# Altium project Biological Payload Data Consolidator.PrjPcb
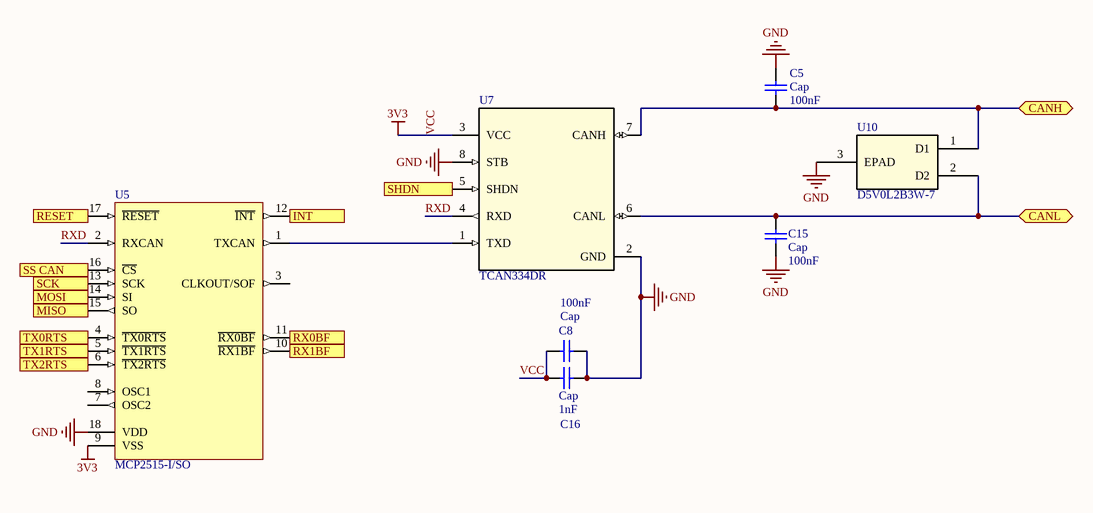
[diagram p0: CAN 3V3new.SchDoc]
8 sheets, 63 parts. Net scope: hierarchical (ports join the sheet entries above them; power ports are global).
Board file: Biological Payload Data Consolidator.PcbDoc
Sheets:
  CAN 3V3new.SchDoc
  BPDC high.SchDoc
    Designator = LSM6DSMTR.SchDoc
    Designator = Biological Payload Data Consolidator.SchDoc
    Boost = Boost.SchDoc
    Designator = Temp Sensor.SchDoc
    Designator = BPDC mid.SchDoc
      Thermo1 = Thermocouple.SchDoc
      Thermo2 = Thermocouple.SchDoc
      Thermo3 = Thermocouple.SchDoc
      Thermo4 = Thermocouple.SchDoc

## Sheet CAN 3V3new.SchDoc
size A

### Parts
C5  Cap  value 100nF  [1608[0603]]
C8  Cap  value 100nF  [1608[0603]]
C15  Cap  value 100nF  [1608[0603]]
C16  Cap  value 1nF  [1608[0603]]
U5  MCP2515-I/SO  [SOIC-SO18_L]
U7  TCAN334DR  [D0008A_N]
U10  D5V0L2B3W-7  [SOT-323_DIO]

### Ports
CANH (bidir), CANL (bidir), INT (out), MISO (out), MOSI (in), RESET (in), RX0BF (out), RX1BF (out), SCK (in), SHDN (in), SS CAN (in), TX0RTS (in), TX1RTS (in), TX2RTS (in)

### Nets
GND: C5.1 C8.2 C15.1 C16.1 U5.18(VDD) U7.2(GND) U7.8(STB) U10.3(EPAD)
VCC: C8.1 C16.2 U5.9(VSS) U7.3(VCC)  [also labelled 3V3]
RXD: U5.2(RXCAN) U7.4(RXD)
NetC5_2: C5.2 U7.7(CANH) U10.1(D1) ; port CANH
NetC15_2: C15.2 U7.6(CANL) U10.2(D2) ; port CANL
NetU5_1: U5.1(TXCAN) U7.1(TXD)
NetU5_4: U5.4(~{TX0RTS}) ; port TX0RTS
NetU5_5: U5.5(~{TX1RTS}) ; port TX1RTS
NetU5_6: U5.6(~{TX2RTS}) ; port TX2RTS
NetU5_10: U5.10(~{RX1BF}) ; port RX1BF
NetU5_11: U5.11(~{RX0BF}) ; port RX0BF
NetU5_12: U5.12(~{INT}) ; port INT
NetU5_13: U5.13(SCK) ; port SCK
NetU5_14: U5.14(SI) ; port MOSI
NetU5_15: U5.15(SO) ; port MISO
NetU5_16: U5.16(~{CS}) ; port SS CAN
NetU5_17: U5.17(~{RESET}) ; port RESET
NetU7_5: U7.5(SHDN) ; port SHDN

Not connected (* = marked no-connect by the designer): U5 3(CLKOUT/SOF) 7(OSC2) 8(OSC1)

### Library data of the parts
C5 C8 C15 C16 = Cap: Capacitor; Published: 8-Jun-2000; LatestRevisionDate: 17-Jul-2002; LatestRevisionNote: Re-released for DXP Platform.; PackageReference: RAD-0.3; Publisher: Altium Limited; PackageDescription: Radial Cap, Thru-Hole; 2 Leads; 0.3 in Pin Spacing
U5 = CMP-0186-00133-2: Stand-Alone CAN Controller With SPI Interface, 18-Pin SOIC, Industrial Temperature; ComponentLink2Description: Datasheet; RevisionNote: URLs added. DatasheetVersion updated.; PackageVersion: revBB, Aug-2009; ComponentLink1URL: http://www.microchip.com/; PackageReference: SOIC-SO18; PackageDescription: 18-Lead Plastic Small Outline (SO) - Wide 7.50mm Body [SOIC]; DatasheetVersion: revF, Oct-2010; ComponentLink2URL: http://ww1.microchip.com/downloads/en/DeviceDoc/21801f.pdf; ComponentLink3URL: http://www.microchip.com/stellent/groups/techpub_sg/documents/packagingspec/en012702.pdf; Code_JEDEC: MS-013; ComponentLink3Description: Package Specification; ComponentLink1Description: Manufacturer URL
U7 = TCAN334DR: No Description Available; Manufacturer: Texas Instruments; PartNumber: TCAN334DR; RefDes: RefDes; Type: DEV; Value: Value; Copyright: Copyright (C) 2018 Accelerated Designs. All rights reserved
U10 = D5V0L2B3W-7: No Description Available; Vendor: Diodes Inc; Built_By: EMA_UL_Team; SourceLibrary: DIODESINC_2_2015-08-18; Manufacturer_Part_Number: D5V0L2B3W-7; Copyright: Copyright (C) 2018 Accelerated Designs. All rights reserved; RefDes: RefDes; Type: DEV

## Sheet BPDC high.SchDoc
size A
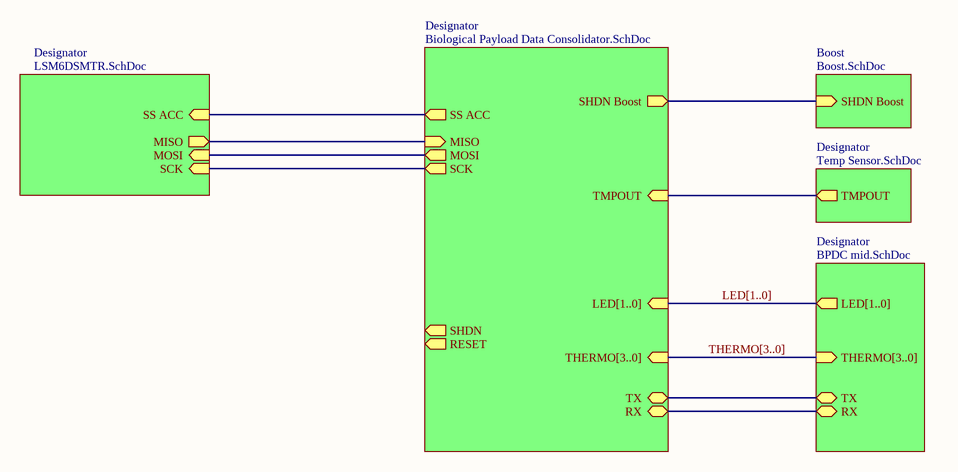
[diagram p1: BPDC high.SchDoc]

### Sub-sheets
Boost = Boost.SchDoc: SHDN Boost (in)
Designator = LSM6DSMTR.SchDoc: MOSI (in), MISO (out), SCK (in), SS ACC (in)
Designator = Biological Payload Data Consolidator.SchDoc: THERMO[3..0] (in), MOSI (out), SS ACC (out), SCK (out), TMPOUT (in), LED[1..0] (in), RESET (out), MISO (in), SHDN (out), SHDN Boost (out), TX (bidir), RX (bidir)
Designator = Temp Sensor.SchDoc: TMPOUT (out)
Designator = BPDC mid.SchDoc: THERMO[3..0] (in), LED[1..0] (out), RX (bidir), TX (bidir)

### Nets
SCK: sheet Designator/SCK, sheet Designator/SCK
SS ACC: sheet Designator/SS ACC, sheet Designator/SS ACC
TMPOUT: sheet Designator/TMPOUT, sheet Designator/TMPOUT
NetJ4_1: sheet Designator/TX, sheet Designator/TX
NetJ4_2: sheet Designator/RX, sheet Designator/RX
NetP2_3: sheet Designator/MISO, sheet Designator/MISO
NetR7_2: sheet Designator/SHDN Boost, sheet Boost/SHDN Boost
NetU2_4: sheet Designator/MOSI, sheet Designator/MOSI

### Buses and harness runs
bus LED[1..0] = sheet Designator/LED[1..0]
bus THERMO[3..0] = sheet Designator/THERMO[3..0]

## Sheet LSM6DSMTR.SchDoc
size A
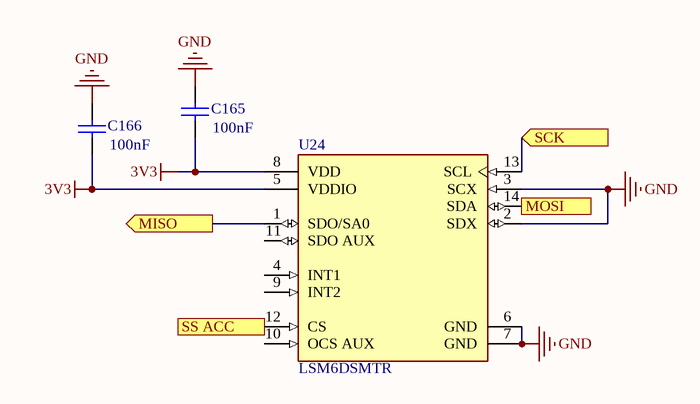
[diagram p2: LSM6DSMTR.SchDoc]

### Parts
C165  value 100nF  [1608[0603]]  (hidden comment: Cap)
C166  value 100nF  [1608[0603]]  (hidden comment: Cap)
U24  LSM6DSMTR  [FP-LGA-14L-DM00249496-MFG]

### Ports
MISO (out), MOSI (in), SCK (in), SS ACC (in)

### Nets
3V3: C165.2 C166.2 U24.5(VDDIO) U24.8(VDD)  [project net VCC]
GND: C165.1 C166.1 U24.2(SDX) U24.3(SCX) U24.6(GND) U24.7(GND)
SCK: U24.13(SCL) ; port SCK
SS ACC: U24.12(CS) ; port SS ACC
NetP2_3: U24.1(SDO/SA0) ; port MISO
NetU2_4: U24.14(SDA) ; port MOSI

Not connected (* = marked no-connect by the designer): U24 4(INT1) 9(INT2) 10(OCS_AUX) 11(SDO_AUX)

### Library data of the parts
C165 C166 = Cap: Capacitor; Published: 8-Jun-2000; LatestRevisionDate: 17-Jul-2002; LatestRevisionNote: Re-released for DXP Platform.; PackageReference: RAD-0.3; Publisher: Altium Limited; PackageDescription: Radial Cap, Thru-Hole; 2 Leads; 0.3 in Pin Spacing
U24 = CMP-12177-000008-1: IMU ACCEL/GYRO I2C/SPI 14LGA; Manufacturer: STMicroelectronics; Operating Supply Current: 0.29-0.65mA; Gyro Range: 125/250/500/1000/2000°/s; Sensor Output: I2C,SPI; Accel Range: 2/4/8/16g; Min Supply Voltage: 1.62V; Resolution: 16bits; Sensor Type: Temperature,Accelerometer,Gyroscope; Max Supply Voltage: 3.6V; Manufacturer Part Number: LSM6DSMTR; Octopart: https://octopart.com/lsm6dsmtr-stmicroelectronics-66358194; Height: 0.86mm; Category: IC; Lead Free: Yes; Temperature: -40°C to +85°C; Temperature Range Low: -40°C; ComponentLink2Description: Datasheet; ComponentLink2URL: https://www.st.com/resource/en/datasheet/lsm6dsm.pdf; Digikey Description: IMU ACCEL/GYRO I2C/SPI 14LGA; Footprint Url: https://www.st.com/content/ccc/resource/technical/document/technical_note/73/17/9c/16/dd/96/4a/01/CD00134799.pdf/files/CD00134799.pdf/jcr:content/translations/en.CD00134799.pdf; Device Class L1: Sensors; Device Class L2: Motion Sensors; Temperature Range High: +85°C; Mouser Description: LSM6DSM Series 3.6 V I2C/SPI 3D Accelerometer and 3D Gyroscope - LGA-14; Device Class L3: Inertial Measurement Units (IMUs); Automotive: No; Package: LGA-14L-DM00249496; RoHS: TRUE

## Sheet Biological Payload Data Consolidator.SchDoc
size A
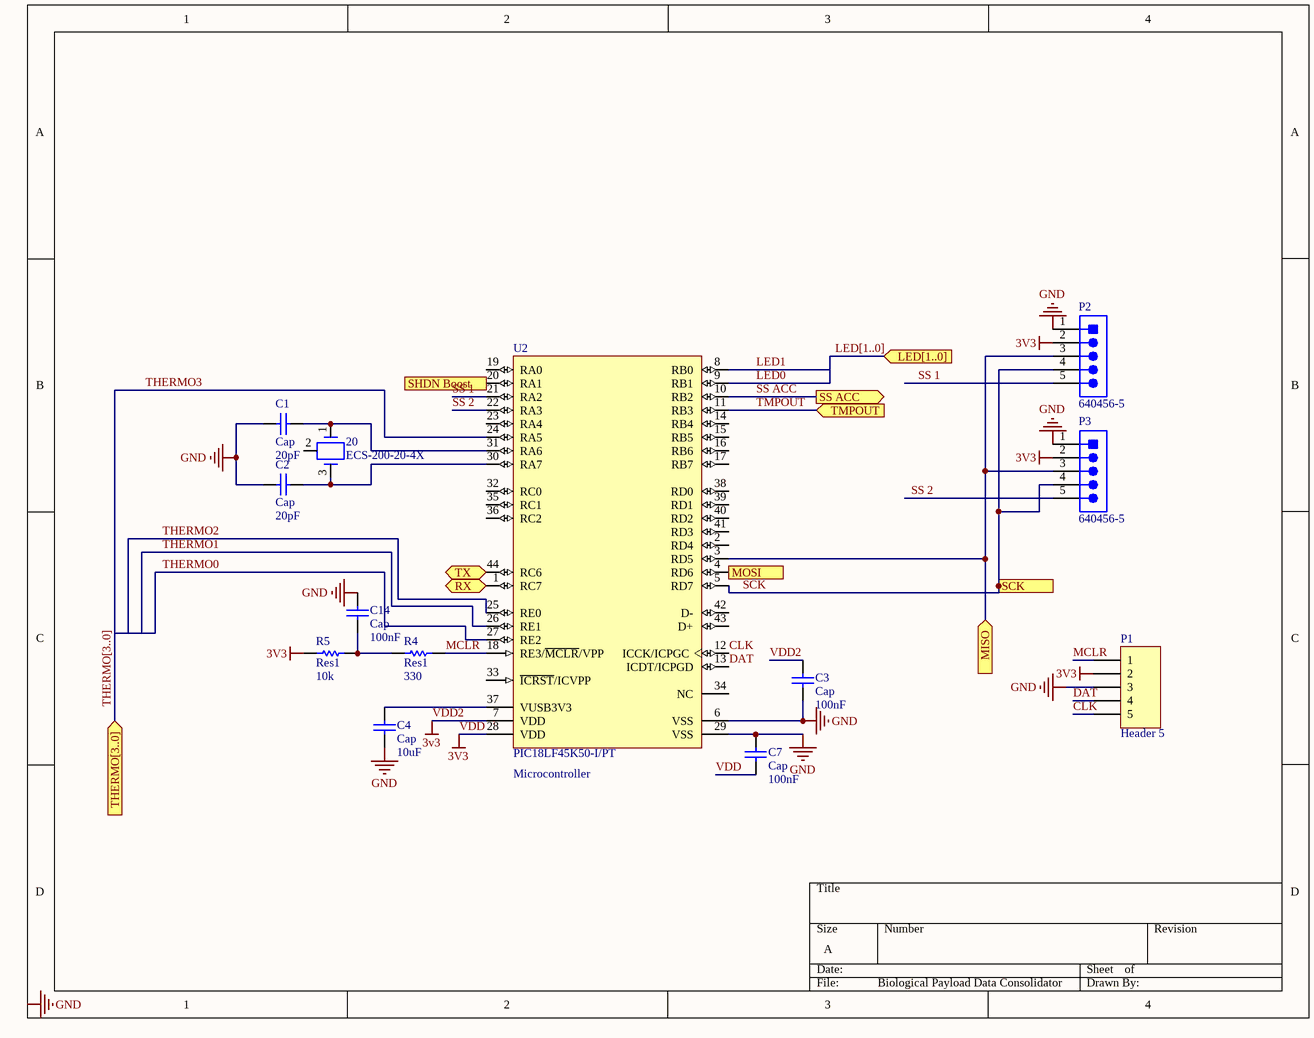
[diagram p3: Biological Payload Data Consolidator.SchDoc]

### Parts
20  ECS-200-20-4X  [ECS-4X-3IL]
C1  Cap  value 20pF  [0402-A]
C2  Cap  value 20pF  [0402-A]
C3  Cap  value 100nF  [1608[0603]]
C4  Cap  value 10uF  [6-0805_M]
C7  Cap  value 100nF  [1608[0603]]
C14  Cap  value 100nF  [1608[0603]]
P1  Header 5  [HDR1X5]
P2  640456-5  [TECO-640456-5]
P3  640456-5  [TECO-640456-5]
R4  Res1  value 330  [1608[0603]]
R5  Res1  value 10k  [0402-A]
U2  PIC18LF45K50-I/PT  [MCHP-TQFP-PT44_L]

### Ports
LED[1..0] (in), MISO (in), MOSI (out), RX (bidir), SCK (out), SHDN Boost (out), SS ACC (out), THERMO[3..0] (in), TMPOUT (in), TX (bidir)

### Nets
3v3: C3.2 C7.2 P1.2 P2.2(RXI) P3.2(RXI) R5.2 U2.7(VDD) U2.28(VDD)  [also labelled VDD, VDD2]  [project net VCC]
GND: C1.2 C2.1 C3.1 C4.2 C7.1 C14.1 P1.3 P2.1(DTR) P3.1(DTR) U2.6(VSS) U2.29(VSS)
CLK: P1.5 U2.12(ICCK/ICPGC)
DAT: P1.4 U2.13(ICDT/ICPGD)
LED0: U2.9(RB1)
LED1: U2.8(RB0)
MCLR: P1.1 R4.2 U2.18(RE3/~{MCLR}/VPP)
SCK: P2.4(VCC) P3.4(VCC) U2.5(RD7) ; port SCK
SS 1: P2.5(CTS) U2.21(RA2)
SS 2: P3.5(CTS) U2.22(RA3)
SS ACC: U2.10(RB2) ; port SS ACC
THERMO0: U2.27(RE2)
THERMO1: U2.26(RE1)
THERMO2: U2.25(RE0)
THERMO3: U2.24(RA5)
TMPOUT: U2.11(RB3) ; port TMPOUT
Net20_1: 20.1 C1.1 U2.31(RA6)
Net20_3: 20.3 C2.2 U2.30(RA7)
NetC4_1: C4.1 U2.37(VUSB3V3)
NetC14_2: C14.2 R4.1 R5.1
NetJ4_1: U2.44(RC6) ; port TX
NetJ4_2: U2.1(RC7) ; port RX
NetP2_3: P2.3(TXO) P3.3(TXO) U2.3(RD5) ; port MISO
NetR7_2: U2.20(RA1) ; port SHDN Boost
NetU2_4: U2.4(RD6) ; port MOSI

Not connected (* = marked no-connect by the designer): 20 2; U2 2(RD4) 14(RB4) 15(RB5) 16(RB6) 17(RB7) 19(RA0) 23(RA4) 32(RC0) 33(~{ICRST}/ICVPP) 34(NC) 35(RC1) 36(RC2) 38(RD0) 39(RD1) 40(RD2) 41(RD3) 42(D-) 43(D+)

### Buses and harness runs
bus LED[1..0] = port LED[1..0]
bus THERMO[3..0] = port THERMO[3..0]

### Notes on the sheet
- (near U2) Microcontroller
- Labels drawn without touching a wire or pin: GND

### Library data of the parts
20 = CMP-1669-00001-2: CRYSTAL 20.000MHZ 20PF 49US; Manufacturer: ECS; ComponentLink1URL: http://www.ecsxtal.com/store/pdf/hc-49usx.pdf; PartNumber: ECS-200-20-4X; ComponentLink1Description: Datasheet; PackageReference: 4X-3IL
C1-C4 C7 C14 = Cap: Capacitor; Published: 8-Jun-2000; LatestRevisionDate: 17-Jul-2002; LatestRevisionNote: Re-released for DXP Platform.; PackageReference: RAD-0.3; Publisher: Altium Limited; PackageDescription: Radial Cap, Thru-Hole; 2 Leads; 0.3 in Pin Spacing
P1 = Header 5: Header, 5-Pin; LatestRevisionDate: 17-Jul-2002; LatestRevisionNote: Re-released for DXP Platform.; Publisher: Altium Limited
P2 P3 = CMP-1684-00014-1: Male Header, Pitch 2.54 mm, 1 x 5 Position, Height 10.03 mm, Tail Length 3.56 mm, / -55 to 105 degC, RoHS, Bulk; Manufacturer: TE Connectivity; Material, Housing: Polyester; Brand/Series: MTA-100Series; Color, Housing: White; Current, Rating: 5 / A; Temperature, Operating: -55to+105 / °C; Connector Type: MTA-100; Agency Approvals: CSA,UL; Material, Contact: CopperAlloy; Mounting Hole Size: 0.04 / "; Voltage, Rating: 250 / V; Contact Termination Area Plating: Tin; Pin Spacing: 0.1 / "; Primary Type: InterconnectSystem; Special Features: Pinstrip; Mount Angle: Vertical; Contact Centerline Spacing: 0.100 / in.; Number of Contacts: 5; Standards: RoHSCompliant,ELVCompliant,UL94V-0; Angle: Straight; Length, Terminal Post: 0.14 / in.; Manufacturer URL: http://www.te.com; Flammability Rating: UL94V-0; Mounting Type: PCMount; Termination: Solder; Package Reference: THD; Length, Overall: 0.5 / "; Contact Mating Area Plating: Tin; Length, Pin: 0.14 / "; Datasheet URL: http://sigma.octopart.com/77881742/technical_drawing/TE-Connectivity-640456-5.pdf; Package Description: Male Header, Pitch 2.54 mm, 1 x 5 Position, Height 10.03 mm, Tail Length 3.56 mm; Datasheet Version: Rev. W3; Contact Plating: Tin; Color: White; Number of Positions: 5; Type: PCBPlug; Contact Shape: Square; Number of Rows: 1; Size, Post: 0.025 / in.
R4 R5 = Res1: Resistor; Published: 8-Jun-2000; LatestRevisionDate: 17-Jul-2002; LatestRevisionNote: Re-released for DXP Platform.; PackageReference: AXIAL-0.3; Publisher: Altium Limited; PackageDescription: Axial Device, Thru-Hole; 2 Leads; 0.3 in Pin Spacing
U2 = CMP-0116-01766-1: Low-Power, High-Performance Microcontroller with XLP Technology, 48 MHz, 36 I/O, -40 to 85 degC, 44-pin TQFP (PT44), Tray; Manufacturer: Microchip; Timers: 2 - 8-bit, 2 - 16-bit, 0 - 32-bit; Operation Voltage Range: 1.8V - 3.6V; RAM: 2048; Max. CPU Speed MHz: 48; Memory Type: Flash; Program Memory KWords: 16; EEPROM Data Memory (bytes): 256; Internal Oscillator: 16 MHz, 31 kHz; I/O Pins: 36; Program Memory KBytes: 32; # of A/D Channels: 25; Digital Communication: 1 -A/E/USART, 1 -MSSP(SPI/I2C); ComponentLink3URL: Product URL:http://www.microchip.com/datasheet/PIC18F45K50; PackageReference: TQFP-PT44; Packing: TRAY; PartNumber: PIC18LF45K50-I/PT; Mounting Technology: Surface Mount; PackageVersion: C04-076B, 12/2012; PackageDescription: 44-Lead Plastic Thin Quad Flatpack, 10 x 10 mm Body, 0.8 mm Pitch; ComponentLink2URL: http://www.microchip.com/stellent/groups/techpub_sg/documents/packagingspec/en012702.pdf; ComponentLink3Description: URL Link1; ComponentLink2Description: Package Specification; DatasheetVersion: Rev. A; ComponentLink1URL: http://ww1.microchip.com/downloads/en/DeviceDoc/30684A.pdf; ComponentLink1Description: Datasheet

## Sheet Boost.SchDoc
size A
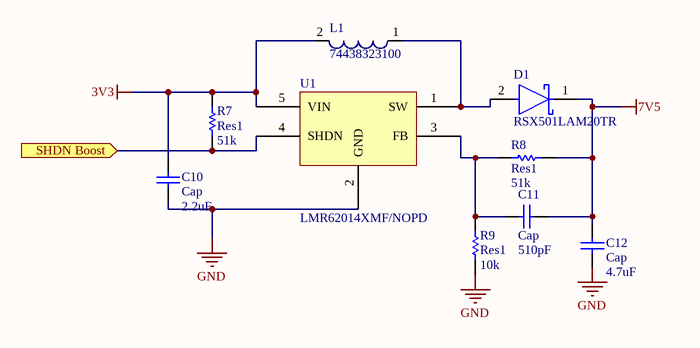
[diagram p4: Boost.SchDoc]

### Parts
C10  Cap  value 2.2uF  [1608[0603]]
C11  Cap  value 510pF  [6-0805_M]
C12  Cap  value 4.7uF  [6-0805_M]
D1  RSX501LAM20TR  [FP-PMDTM-MFG]
L1  74438323100  [SMD 2510]
R7  Res1  value 51k  [1608[0603]]
R8  Res1  value 51k  [1608[0603]]
R9  Res1  value 10k  [0402-A]
U1  LMR62014XMF/NOPD  [SOT95P280X145-5N]

### Ports
SHDN Boost (in)

### Nets
3V3: C10.2 L1.2 R7.1 U1.5(VIN)  [project net VCC]
7V5: C11.1 C12.2 D1.1(C) R8.2
GND: C10.1 C12.1 R9.2 U1.2(GND)
NetC11_2: C11.2 R8.1 R9.1 U1.3(FB)
NetD1_2: D1.2(A) L1.1 U1.1(SW)
NetR7_2: R7.2 U1.4(SHDN) ; port SHDN Boost

### Library data of the parts
C10-C12 = Cap: Capacitor; Published: 8-Jun-2000; LatestRevisionDate: 17-Jul-2002; LatestRevisionNote: Re-released for DXP Platform.; PackageReference: RAD-0.3; Publisher: Altium Limited; PackageDescription: Radial Cap, Thru-Hole; 2 Leads; 0.3 in Pin Spacing
D1 = CMP-08971-000008-1: DIODE SCHOTTKY 20V 5A PMDTM; Manufacturer: Rohm; Max Surge Forward Current: 100A; Max Junction Temp: +125°C; Description: Diode Schottky 20V 5A Surface Mount PMDTM; Max Repetitive Reverse Voltage: 25V; Peak Reverse Current: 500uA; Automotive: No; Digikey Description: DIODE SCHOTTKY 20V 5A PMDTM; Temperature Range High: +125°C; Height: 1.05mm; Octopart: https://octopart.com/rsx501lam20tr-rohm-82270774; Lead Free: Yes; ComponentLink2URL: https://fscdn.rohm.com/en/products/databook/datasheet/discrete/diode/schottky_barrier/rsx501lam20tr-e.pdf; Device Class L2: Diodes; ComponentLink2Description: Datasheet; Device Class L1: Discrete Semiconductors; RoHS: TRUE; Reverse Voltage: 20V; Package: PMDTM; Category: Diode; Temperature: to +125°C; Device Class L3: Schottky Diodes; Manufacturer Part Number: RSX501LAM20TR; Forward Current: 5A
L1 = CMP-1411-00017-1: Power Multilayer Inductor WE-MAPI, L=10.0µH; Manufacturer: Wuerth Elektronik; Inductance: 10.0ÂµH; PartNumber: 74438323100; ComponentLink1URL: http://www.we-online.com; ComponentLink2Description: Datasheet; ComponentLink1Description: Manufacturer URL; PackageReference: SMD 2510; ComponentLink2URL: http://katalog.we-online.de/kataloge/eisos/media/pdf/74438323100.pdf
R7-R9 = Res1: Resistor; Published: 8-Jun-2000; LatestRevisionDate: 17-Jul-2002; LatestRevisionNote: Re-released for DXP Platform.; PackageReference: AXIAL-0.3; Publisher: Altium Limited; PackageDescription: Axial Device, Thru-Hole; 2 Leads; 0.3 in Pin Spacing

## Sheet Temp Sensor.SchDoc
size A
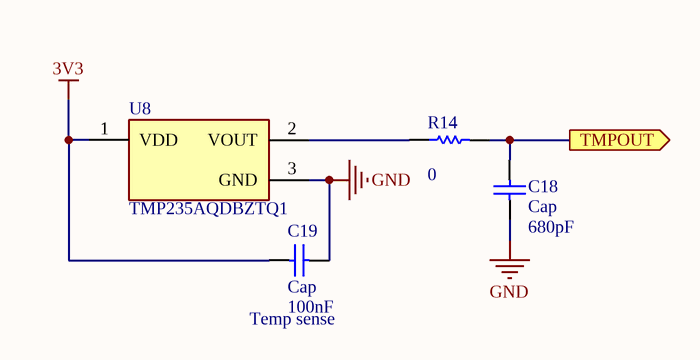
[diagram p5: Temp Sensor.SchDoc]

### Parts
C18  Cap  value 680pF  [1608[0603]]
C19  Cap  value 100nF  [1608[0603]]
R14  value 0  [0402-A]  (hidden comment: Res1)
U8  TMP235AQDBZTQ1  [FP-DBZ0003A-MFG]

### Ports
TMPOUT (out)

### Nets
3V3: C19.2 U8.1(VDD)  [project net VCC]
GND: C18.1 C19.1 U8.3(GND)
TMPOUT: C18.2 R14.2 ; port TMPOUT
NetR14_1: R14.1 U8.2(VOUT)

### Notes on the sheet
- (near C19) Temp sense

### Library data of the parts
C18 C19 = Cap: Capacitor; Published: 8-Jun-2000; LatestRevisionDate: 17-Jul-2002; LatestRevisionNote: Re-released for DXP Platform.; PackageReference: RAD-0.3; Publisher: Altium Limited; PackageDescription: Radial Cap, Thru-Hole; 2 Leads; 0.3 in Pin Spacing
R14 = Res1: Resistor; Published: 8-Jun-2000; LatestRevisionDate: 17-Jul-2002; LatestRevisionNote: Re-released for DXP Platform.; PackageReference: AXIAL-0.3; Publisher: Altium Limited; PackageDescription: Axial Device, Thru-Hole; 2 Leads; 0.3 in Pin Spacing
U8 = CMP-04948-000003-1: LOW-POWER HIGH-ACCURACY ANALOG O; Manufacturer: Texas Instruments; Manufacturer Part Number: TMP235A2DBZR; Output Current: 500uA; Operating Supply Current: 9uA; Max Supply Voltage: 5.5V; Max Junction Temp: +150°C; Accuracy: 0.5%; Min Supply Voltage: 2.3V; Standoff Height: 0.01mm; Sensor Output: Analog Voltage; Ambient Temperature Range Low: -40°C; Device Class L2: Temperature and Humidity Sensors; Digikey Description: LOW-POWER HIGH-ACCURACY ANALOG O; Lead Free: Yes; Category: IC; Device Class L3: unset; Temperature Range Low: -40°C; ComponentLink2Description: Datasheet; Package: DBZ0003A; Octopart: https://octopart.com/tmp235a2dbzr-texas+instruments-94966376; Device Class L1: Sensors; Temperature Range High: +150°C; Height: 1.12mm; Temperature: -40°C to +150°C; RoHS: TRUE; Ambient Temperature Range High: +150°C; Automotive: No; ComponentLink2URL: http://www.ti.com/lit/ds/symlink/tmp235.pdf; Mouser Description: ±2°C Analog output temperature sensor, with 10mV /°C gain 3-SOT-23 -40 to 150

## Sheet BPDC mid.SchDoc
size A
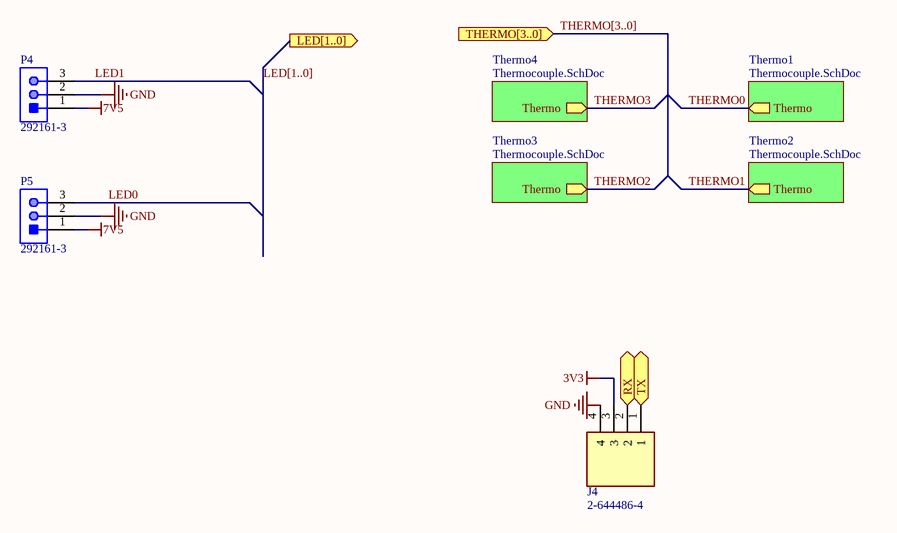
[diagram p6: BPDC mid.SchDoc]

### Parts
J4  2-644486-4  [26444864]
P4  292161-3  [TECO-292161-3_V]
P5  292161-3  [TECO-292161-3_V]

### Sub-sheets
Thermo1 = Thermocouple.SchDoc: Thermo (out)
Thermo2 = Thermocouple.SchDoc: Thermo (out)
Thermo3 = Thermocouple.SchDoc: Thermo (out)
Thermo4 = Thermocouple.SchDoc: Thermo (out)

### Ports
LED[1..0] (out), RX (bidir), THERMO[3..0] (in), TX (bidir)

### Nets
3V3: J4.3  [project net VCC]
7V5: P4.1 P5.1
GND: J4.4 P4.2 P5.2
LED0: P5.3
LED1: P4.3
NetJ4_1: J4.1 ; port TX
NetJ4_2: J4.2 ; port RX

### Buses and harness runs
bus LED[1..0] =  = port LED[1..0]
bus THERMO[3..0] = port THERMO[3..0]

### Library data of the parts
J4 = 2-644486-4: Connector; Manufacturer_Name: TE Connectivity; Datasheet Link: http://www.te.com/commerce/DocumentDelivery/DDEController?Action=showdoc&DocId=Customer+Drawing%7F644486%7FL%7Fpdf%7FEnglish%7FENG_CD_644486_L_baseFilename.pdf%7F2-644486-4.pdf; Height: 10.668mm; Manufacturer_Part_Number: 2-644486-4; Mouser Part Number: 571-2-644486-4; Mouser Price/Stock: https://www.mouser.co.uk/ProductDetail/TE-Connectivity-AMP/2-644486-4?qs=8XyASyDp%2FcDn2y5ith8QSA%3D%3D; Arrow Part Number: 2-644486-4; Arrow Price/Stock: https://www.arrow.com/en/products/2-644486-4/te-connectivity
P4 P5 = CMP-2000-05551-1: Male Header, Pitch 2 mm, 1 x 3 Position, Height 6.8 mm, Tail Length 3.2 mm, -40 to 105 degC, RoHS, Bulk; Manufacturer: TE Connectivity; SVHC: NoSVHC(15-Jun-2015); Pitch Spacing: 2mm; Contact Termination Type: ThroughHole; No. of Rows: 1Rows; No. of Contacts: 3Contacts; Product Range: AMPCTSeries; Mounting Technology: ThroughHole; Manufacturer URL: http://www.te.com/; Contact Material: Brass; Datasheet URL: http://www.te.com/commerce/DocumentDelivery/DDEController?Action=showdoc&DocId=Customer+Drawing%7F292161%7FP1%7Fpdf%7FEnglish%7FENG_CD_292161_P1.pdf%7F292161-3; Package Reference: 292161-3; Contact Plating: TinPlatedContacts; Gender: Header; Datasheet Version: Rev. P1, 06/2016; Package Description: Male Header, Pitch 2 mm, 1 x 3 Position, Height 6.8 mm, Tail Length 3.2 mm

## Sheet Thermocouple.SchDoc
size A
Used 4 times, as channels Designator/Thermo1, Designator/Thermo2, Designator/Thermo3, Designator/Thermo4. Parts and nets are listed once, with the designators drawn on the sheet.
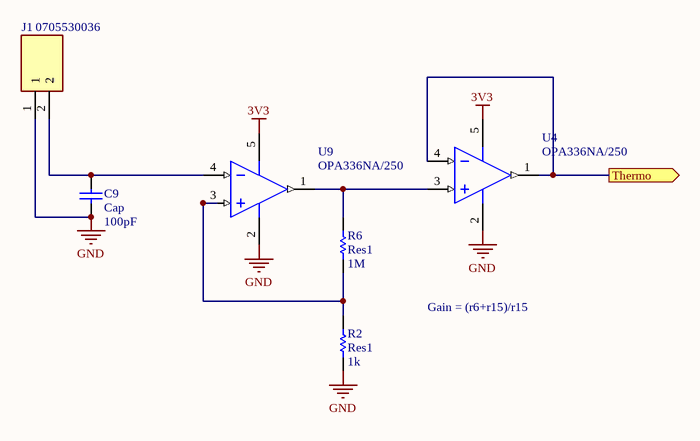
[diagram p7: Thermocouple.SchDoc]

### Parts
C9  Cap  value 100pF  [0402-A]
J1  0705530036  [SHDRRA2W64P0X254_1X2_737X1359X699P]
R2  Res1  value 1k  [0402-A]
R6  Res1  value 1M  [0402-A]
U4  OPA336NA/250  [DBV0005A_M]
U9  OPA336NA/250  [DBV0005A_M]

### Ports
Thermo (out)

### Nets
3V3: U4.5(V+) U9.5(V+)
GND: C9.1 J1.1 R2.2 U4.2(V-) U9.2(V-)
Thermo: U4.1(OUT) U4.4(IN-) ; port Thermo
NetC9_2: C9.2 J1.2 U9.4(IN-)
NetR2_1: R2.1 R6.2 U9.3(IN+)
NetR6_1: R6.1 U4.3(IN+) U9.1(OUT)

### Channels
Designator/Thermo1: designators end in _Thermo1; ports Thermo=THERMO0
Designator/Thermo2: designators end in _Thermo2; ports Thermo=THERMO1
Designator/Thermo3: designators end in _Thermo3; ports Thermo=THERMO2
Designator/Thermo4: designators end in _Thermo4; ports Thermo=THERMO3

### Notes on the sheet
- Gain = (r6+r15)/r15

### Library data of the parts
C9 = Cap: Capacitor; Published: 8-Jun-2000; LatestRevisionDate: 17-Jul-2002; LatestRevisionNote: Re-released for DXP Platform.; PackageReference: RAD-0.3; Publisher: Altium Limited; PackageDescription: Radial Cap, Thru-Hole; 2 Leads; 0.3 in Pin Spacing
J1 = 0705530036: Connector; Manufacturer_Name: Molex; Datasheet Link: https://www.molex.com/pdm_docs/sd/705530036_sd.pdf; Height: 6.99mm; Manufacturer_Part_Number: 0705530036; Mouser Part Number: N/A; Mouser Price/Stock: https://www.mouser.com/Search/Refine.aspx?Keyword=N%2FA; Arrow Part Number: 0705530036; Arrow Price/Stock: https://www.arrow.com/en/products/0705530036/molex
R2 R6 = Res1: Resistor; Published: 8-Jun-2000; LatestRevisionDate: 17-Jul-2002; LatestRevisionNote: Re-released for DXP Platform.; PackageReference: AXIAL-0.3; Publisher: Altium Limited; PackageDescription: Axial Device, Thru-Hole; 2 Leads; 0.3 in Pin Spacing
U4 U9 = CMP-0272-00910-3: Single-Supply, MicroPower CMOS Operational Amplifier MicroAmplifier(TM) Series, 2.3 to 5.5 V, -55 to 125 degC, 5-pin SOT23 (DBV5), Green (RoHS & no Sb/Br); Manufacturer: Texas Instruments; Slew Rate(Typ)(V/us): 0.03; Iq per channel(Max)(mA): 0.032; Number of Channels: 1; Offset Drift(Typ)(uV/C): 1.5; IIB(Max)(pA): 10; Total Supply Voltage(Max)(+5V is 5, +/-5V is 10): 5.5; Vio (25C)(Max)(mV): 0.5; CMRR(Min)(dB): 76; Total Supply Voltage(Min)(+5V is 5, +/-5V is 10): 2.3; Sub Family: Low Input Bias Current Amp (<=10pA), Low Offset Voltage Amplifier (<=500uV), Low Power Amp (<=500uA), Low Supply Voltage Amplifier (<=2.7V), Precision Amplifier; Vn at 1kHz(Typ)(nV/rtHz): 40; DatasheetVersion: SBOS068C; ComponentLink1URL: http://www.ti.com/; ComponentLink2Description: Datasheet; PackageReference: DBV0005A; ComponentLink3Description: Package Specification; ComponentLink2URL: http://www.ti.com/general/docs/lit/getliterature.tsp?genericPartNumber=OPA336&fileType=pdf; Mounting Technology: Surface Mount; Eco-Plan: Green (RoHS & no Sb/Br); Code_JEDEC: MO-178; ComponentLink3URL: http://www.ti.com/litv/pdf/mpds018i; PackageDescription: 5-Pin Plastic Small Outline, Body 1.6 x 2.9 mm, Pitch 0.95 mm; PartNumber: OPA336NA/250; PackageVersion: 4073253-4/K, 03/2006; ComponentLink1Description: Manufacturer URL

## Nets that join several sheets
7V5: Boost (C11.1 C12.2 D1.1 R8.2), BPDC mid (P4.1 P5.1)
GND: CAN 3V3new (8 pins), LSM6DSMTR (6 pins), Biological Payload Data Consolidator (11 pins), Boost (C10.1 C12.1 R9.2 U1.2), Temp Sensor (C18.1 C19.1 U8.3), BPDC mid (J4.4 P4.2 P5.2), Designator/Thermo1 (5 pins), Designator/Thermo2 (5 pins), Designator/Thermo3 (5 pins), Designator/Thermo4 (5 pins)
VCC: CAN 3V3new (C8.1 C16.2 U5.9 U7.3), LSM6DSMTR (C165.2 C166.2 U24.5 U24.8), Biological Payload Data Consolidator (8 pins), Boost (C10.2 L1.2 R7.1 U1.5), Temp Sensor (C19.2 U8.1), BPDC mid (J4.3), Designator/Thermo1 (U4_Thermo1.5 U9_Thermo1.5), Designator/Thermo2 (U4_Thermo2.5 U9_Thermo2.5), Designator/Thermo3 (U4_Thermo3.5 U9_Thermo3.5), Designator/Thermo4 (U4_Thermo4.5 U9_Thermo4.5)
LED0: Biological Payload Data Consolidator (U2.9), BPDC mid (P5.3)
LED1: Biological Payload Data Consolidator (U2.8), BPDC mid (P4.3)
NetJ4_1: Biological Payload Data Consolidator (U2.44), BPDC mid (J4.1)
NetJ4_2: Biological Payload Data Consolidator (U2.1), BPDC mid (J4.2)
NetP2_3: LSM6DSMTR (U24.1), Biological Payload Data Consolidator (P2.3 P3.3 U2.3)
NetR7_2: Biological Payload Data Consolidator (U2.20), Boost (R7.2 U1.4)
NetU2_4: LSM6DSMTR (U24.14), Biological Payload Data Consolidator (U2.4)
SCK: LSM6DSMTR (U24.13), Biological Payload Data Consolidator (P2.4 P3.4 U2.5)
SS ACC: LSM6DSMTR (U24.12), Biological Payload Data Consolidator (U2.10)
THERMO0: Biological Payload Data Consolidator (U2.27), Designator/Thermo1 (U4_Thermo1.1 U4_Thermo1.4)
THERMO1: Biological Payload Data Consolidator (U2.26), Designator/Thermo2 (U4_Thermo2.1 U4_Thermo2.4)
THERMO2: Biological Payload Data Consolidator (U2.25), Designator/Thermo3 (U4_Thermo3.1 U4_Thermo3.4)
THERMO3: Biological Payload Data Consolidator (U2.24), Designator/Thermo4 (U4_Thermo4.1 U4_Thermo4.4)
TMPOUT: Biological Payload Data Consolidator (U2.11), Temp Sensor (C18.2 R14.2)